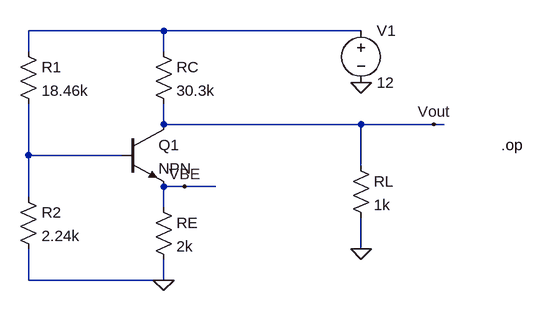
[diagram p0: schematic 4b.asc]
4b.asc, the LTspice schematic file:
Version 4
SHEET 1 880 680
WIRE 176 112 -32 112
WIRE 480 112 176 112
WIRE -32 144 -32 112
WIRE 176 144 176 112
WIRE 176 256 176 224
WIRE 480 256 176 256
WIRE 592 256 480 256
WIRE 608 256 592 256
WIRE -32 304 -32 224
WIRE 112 304 -32 304
WIRE 480 320 480 256
WIRE 208 352 176 352
WIRE 256 352 208 352
WIRE -32 368 -32 304
WIRE 176 384 176 352
WIRE 480 448 480 400
WIRE -32 496 -32 448
WIRE 176 496 176 464
WIRE 176 496 -32 496
FLAG 592 256 Vout
FLAG 480 192 0
FLAG 480 448 0
FLAG 176 496 0
FLAG 208 352 VBE
SYMBOL res -48 128 R0
SYMATTR InstName R1
SYMATTR Value 18.46k
SYMBOL res -48 352 R0
SYMATTR InstName R2
SYMATTR Value 2.24k
SYMBOL res 160 128 R0
SYMATTR InstName RC
SYMATTR Value 30.3k
SYMBOL res 160 368 R0
SYMATTR InstName RE
SYMATTR Value 2k
SYMBOL res 464 304 R0
SYMATTR InstName RL
SYMATTR Value 1k
SYMBOL voltage 480 96 R0
SYMATTR InstName V1
SYMATTR Value 12
SYMBOL npn 112 256 R0
SYMATTR InstName Q1
TEXT 696 288 Left 2 !.op

The netlist it stands for:
* 4b.asc
R1 N001 N002 18.46k
R2 N002 0 2.24k
RC N001 Vout 30.3k
RE VBE 0 2k
RL Vout 0 1k
V1 N001 0 12
Q1 Vout N002 VBE 0 NPN
.model NPN NPN
.model PNP PNP
.lib standard.bjt
.op
.backanno
.end